# Altium schematic sheet magnetic-core-inductor.SchDoc
size A; DocumentNumber: 1; SheetNumber: 1; SheetTotal: 6
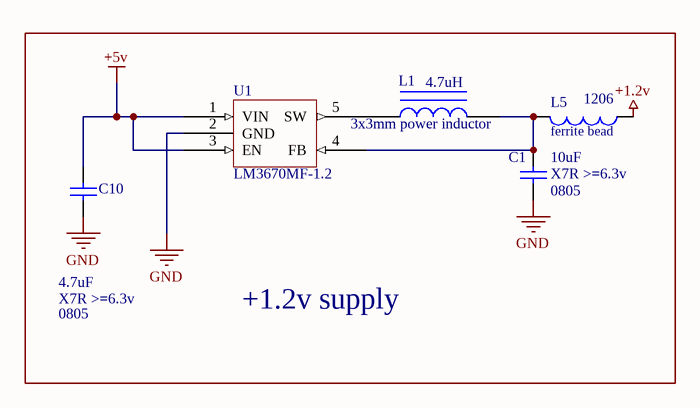
[diagram p0: magnetic-core-inductor.SchDoc]

## Parts
C1  value 10uF  PackageReference: 0805  Rating: X7R >=6.3v  [CAPC2012N]  (hidden comment: Cap Semi)
C10  value 4.7uF  PackageReference: 0805  Rating: X7R >=6.3v  [CAPC2012N]  (hidden comment: Cap Semi)
L1  3x3mm power inductor  value 4.7uH  [3x3mm inductor]
L5  ferrite bead  PackageReference: 1206  [INDC3216N]
U1  value LM3670MF-1.2  [SOT23-5AN]  (hidden comment: LM3670MF-1.2/NOPB)

## Blocks framed on the sheet
+1.2v supply: C1 C10 L1 L5 U1

## Nets
+1.2v: L5.1
+5v: C10.2 U1.1(VIN) U1.3(EN)
GND: C1.1 C10.1 U1.2(GND)
NetC1_2: C1.2 L1.2 L5.2 U1.4(FB)
NetL1_1: L1.1 U1.5(SW)

## Library data of the parts
C1 = Cap Semi: Capacitor (Semiconductor SIM Model); Tolerance: ±10%; Substitutable: yes; Supplier 1: Mouser; Supplier Part Number 1: 81-GRM21BR61A106KE19
C10 = Cap: Capacitor; Tolerance: -20%, +80%; Substitutable: yes; Supplier 1: Digi-Key; Supplier Part Number 1: 445-1370-1-ND
L1 = Inductor Iron: Magnetic-Core Inductor; Substitutable: yes; PackageReference: AXIAL-0.9; Supplier 1: Mouser; Supplier Part Number 1: 652-SRN3015-4R7M
L5 = Inductor: VALUE: 0; Substitutable: yes; Supplier 1: Mouser; Supplier Part Number 1: 81-BLM18KG121TN1D
U1 = LM3670: LM3670 buck step-down regulator, 350 mA; Substitutable: no; Supplier 1: Mouser; Supplier Part Number 1: 926-LM3670MF33NOPB; PackageReference: SOT23-5